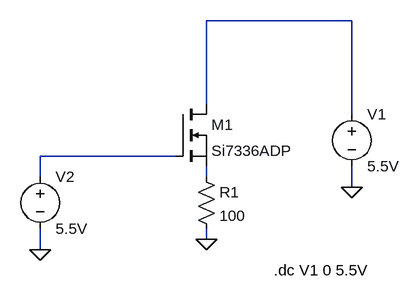
[diagram p0: schematic IsolationTest.asc]
IsolationTest.asc, the LTspice schematic file:
Version 4
SHEET 1 880 680
WIRE 624 192 400 192
WIRE 400 320 400 192
WIRE 624 336 624 192
WIRE 352 400 144 400
WIRE 144 432 144 400
WIRE 400 432 400 416
WIRE 624 448 624 416
WIRE 400 528 400 512
WIRE 144 544 144 512
FLAG 400 528 0
FLAG 624 448 0
FLAG 144 544 0
SYMBOL nmos 352 320 R0
SYMATTR InstName M1
SYMATTR Value Si7336ADP
SYMBOL voltage 624 320 R0
SYMATTR InstName V1
SYMATTR Value 5.5V
SYMBOL res 384 416 R0
SYMATTR InstName R1
SYMATTR Value 100
SYMBOL voltage 144 416 R0
SYMATTR InstName V2
SYMATTR Value 5.5V
TEXT 504 576 Left 2 !.dc V1 0 5.5V

The netlist it stands for:
* IsolationTest.asc
M1 N001 N002 N003 N003 Si7336ADP
V1 N001 0 5.5V
R1 N003 0 100
V2 N002 0 5.5V
.model NMOS NMOS
.model PMOS PMOS
.lib standard.mos
.dc V1 0 5.5V
.backanno
.end